# EAGLE design Rocketometer9250_2 (EAGLE 6.2)
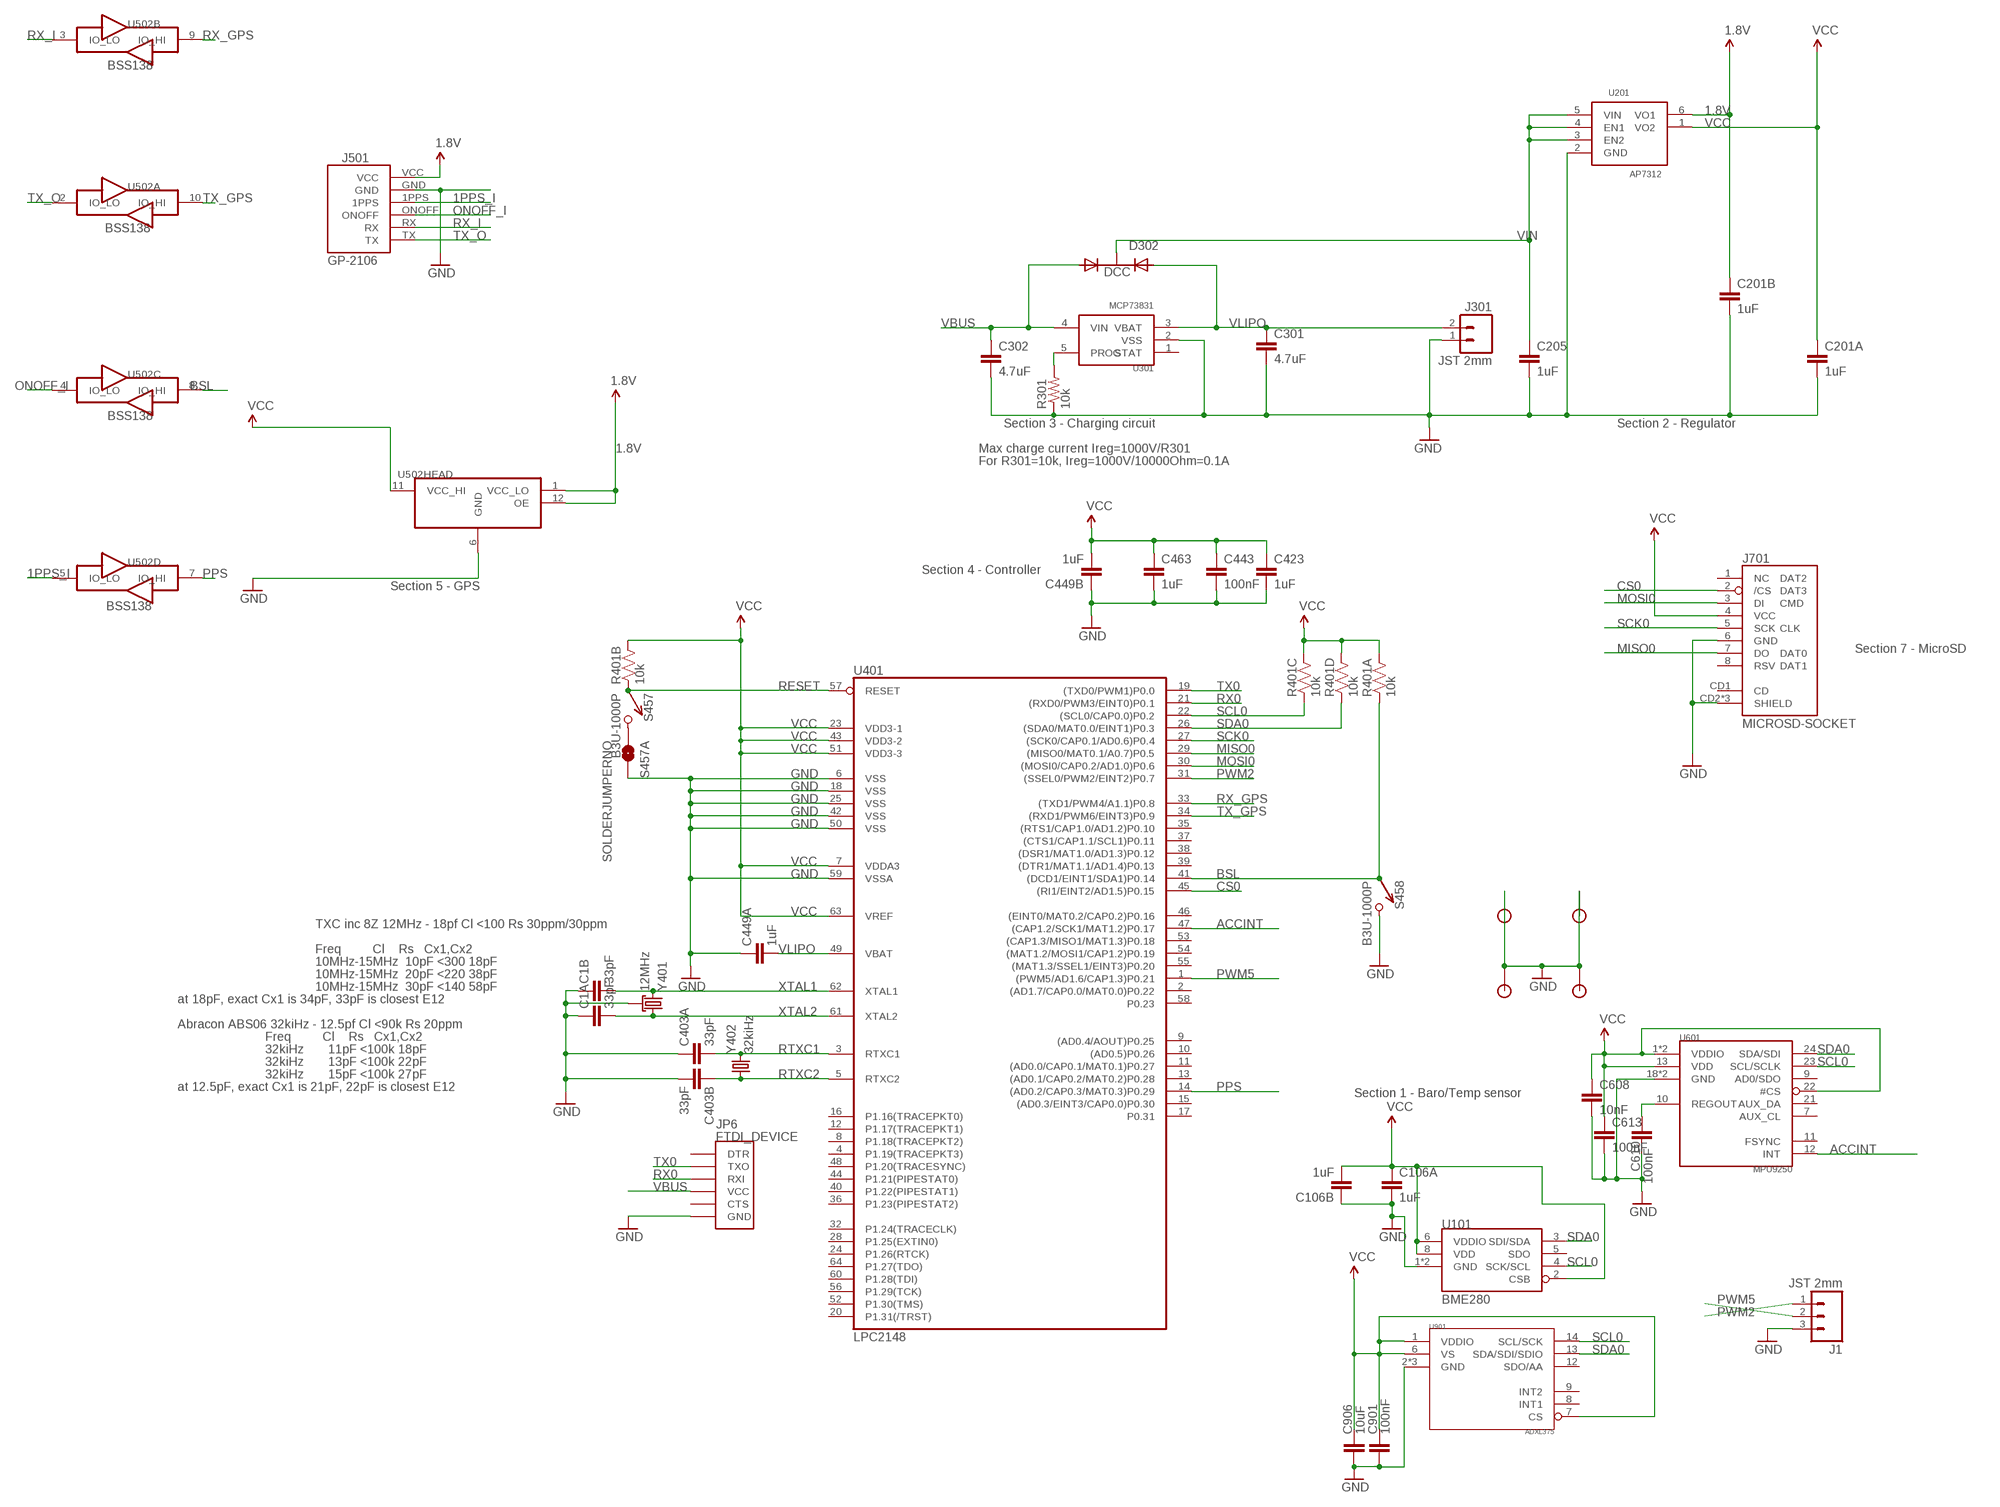
[diagram p0: schematic, sheet 1]

## Parts
C1  33pF  CKCM25  [CKCM25]
C106  1uF  CKCM25  [CKCM25]
C201  1uF  CKCM25  [CKCM25]
C205  1uF  CAP0402-CAP  [0402-CAP]
C301  4.7uF  CAP0402-CAP  [0402-CAP]
C302  4.7uF  CAP0402-CAP  [0402-CAP]
C403  33pF  CKCM25  [CKCM25]
C423  1uF  CAP0402-CAP  [0402-CAP]
C443  100nF  CAP0402-CAP  [0402-CAP]
C449  1uF  CKCM25  [CKCM25]
C463  1uF  CAP0402-CAP  [0402-CAP]
C608  10nF  CAP0402-CAP  [0402-CAP]
C610  100nF  CAP0402-CAP  [0402-CAP]
C613  100nF  CAP0402-CAP  [0402-CAP]
C901  100nF  CAP0402-CAP  [0402-CAP]
C906  10uF  CAP0603-CAP  [0603-CAP]
D302  DCC  PMEG2005CT  [SOT-23-3]
J1  JST 2mm  M031X03_NO_SILK  [1X03_NO_SILK]
J301  JST 2mm  M021X02_NO_SILK  [1X02_NO_SILK]
J501  GP-2106  [GP-2106]
J701  MICROSD-SOCKET  [MICROSD-SOCKET-PP]
JP1  STANDOFF  [STANDOFF]
JP2  STANDOFF  [STANDOFF]
JP4  STANDOFF  [STANDOFF]
JP5  STANDOFF  [STANDOFF]
JP6  FTDI_DEVICE  [FTDI_DEVICE_SIDE]
R301  10k  RESISTOR0402-RES  [0402-RES]
R401  10k  RP404  [CRA04]
S457  B3U-1000P  [B3U-1000P]
S457A  SOLDERJUMPERNO  [SJ_2S-NO]
S458  B3U-1000P  [B3U-1000P]
U101  BME280  [BME280]
U201  AP7312  AP73X2  [SOT-23-6]
U301  MCP73831  [SOT-23-5]
U401  LPC2148  LPC213X  [SQFP-S-10X10-64]
U502  TXB0104RUT  [R-PUQFN-N12]
U601  MPU9250  [LQFN_3MM_3MM]
U901  ADXL375  [ADXL375]
Y401  12MHz  CX2520  [CRYSTAL_SMD_2MM_2_5MM]
Y402  32kiHz  ABS06  [ABS06]

## Nets
1.8V: C201.2 J501.VCC U201.6(VO1) U502.1(HEAD:VCC_LO) U502.12(HEAD:OE)
1PPS_I: J501.1PPS U502.5(D:IO_LO)
ACCINT: U401.47((CAP1.2/SCK1/MAT1.2)P0.17) U601.12(INT)
BSL: R401.1 S458.P$1 U401.41((DCD1/EINT1/SDA1)P0.14) U502.8(C:IO_HI)
CS0: J701.2(/CS) U401.45((RI1/EINT2/AD1.5)P0.15)
GND [power]: C1.1 C1.2 C106.2 C106.4 C201.3 C201.4 C205.2 C301.2 C302.2 C403.1 C403.3 C423.2 C443.2 C449.1 C449.2 C463.2 C608.2 C610.2 C613.2 C901.2 C906.2 J1.3 J301.1 J501.GND J701.6(GND) J701.CD2(SHIELD) J701.GND1(SHIELD) J701.GND3(SHIELD) JP1.P$1 JP2.P$1 JP4.P$1 JP5.P$1 JP6.P$6(GND) R301.1 S457A.2 S458.P$2 U101.1(GND) U101.7(GND) U201.2(GND) U301.2(VSS) U401.6(VSS) U401.18(VSS) U401.25(VSS) U401.42(VSS) U401.50(VSS) U401.59(VSSA) U502.6(HEAD:GND) U601.18(GND) U601.20(GND) U901.2(GND) U901.4(GND) U901.5(GND) Y401.2(GND) Y401.4(GND)
MISO0: J701.7(DO) U401.29((MISO0/MAT0.1/A0.7)P0.5)
MOSI0: J701.3(DI) U401.30((MOSI0/CAP0.2/AD1.0)P0.6)
N$2: R301.2 U301.5(PROG)
N$8: S457.P$2 S457A.1
N$13: C610.1 U601.10(REGOUT)
ONOFF_I: J501.ONOFF U502.4(C:IO_LO)
PPS: U401.14((AD0.2/CAP0.3/MAT0.3)P0.29) U502.7(D:IO_HI)
PWM2: J1.1 U401.31((SSEL0/PWM2/EINT2)P0.7)
PWM5: J1.2 U401.1((PWM5/AD1.6/CAP1.3)P0.21)
RESET [power]: R401.2 S457.P$1 U401.57(RESET)
RTXC1: C403.4 U401.3(RTXC1) Y402.2
RTXC2: C403.2 U401.5(RTXC2) Y402.1
RX0: JP6.P$3(RXI) U401.21((RXD0/PWM3/EINT0)P0.1)
RX_GPS: U401.33((TXD1/PWM4/A1.1)P0.8) U502.9(B:IO_HI)
RX_I: J501.RX U502.3(B:IO_LO)
SCK0: J701.5(SCK) U401.27((SCK0/CAP0.1/AD0.6)P0.4)
SCL0: R401.3 U101.4(SCK/SCL) U401.22((SCL0/CAP0.0)P0.2) U601.23(SCL/SCLK) U901.14(SCL/SCK)
SDA0: R401.4 U101.3(SDI/SDA) U401.26((SDA0/MAT0.0/EINT1)P0.3) U601.24(SDA/SDI) U901.13(SDA/SDI/SDIO)
TX0: JP6.P$2(TXO) U401.19((TXD0/PWM1)P0.0)
TX_GPS: U401.34((RXD1/PWM6/EINT3)P0.9) U502.10(A:IO_HI)
TX_O: J501.TX U502.2(A:IO_LO)
VBUS [power]: C302.1 D302.1(A1) JP6.P$4(VCC) U301.4(VIN)
VCC [power]: C106.1 C106.3 C201.1 C423.1 C443.1 C449.3 C463.1 C608.1 C613.1 C901.1 C906.1 J701.4(VCC) R401.5 R401.6 R401.7 R401.8 U101.2(CSB) U101.6(VDDIO) U101.8(VDD) U201.1(VO2) U401.7(VDDA3) U401.23(VDD3-1) U401.43(VDD3-2) U401.51(VDD3-3) U401.63(VREF) U502.11(HEAD:VCC_HI) U601.1(VDDIO) U601.8(VDDIO) U601.13(VDD) U601.22(#CS) U901.1(VDDIO) U901.6(VS) U901.7(CS)
VIN: C205.1 D302.3(K) U201.3(EN2) U201.4(EN1) U201.5(VIN)
VLIPO [power]: C301.1 C449.4 D302.2(A2) J301.2 U301.3(VBAT) U401.49(VBAT)
XTAL1: C1.3 U401.62(XTAL1) Y401.3
XTAL2: C1.4 U401.61(XTAL2) Y401.1
Unconnected: J701.1(NC) J701.8(RSV) J701.CD1(CD) JP6.P$1(DTR) JP6.P$5(CTS) U101.5(SDO) U301.1(STAT) U401.2((AD1.7/CAP0.0/MAT0.0)P0.22) U401.4(P1.19(TRACEPKT3)) U401.8(P1.18(TRACEPKT2)) U401.9((AD0.4/AOUT)P0.25) U401.10((AD0.5)P0.26) U401.11((AD0.0/CAP0.1/MAT0.1)P0.27) U401.12(P1.17(TRACEPKT1)) U401.13((AD0.1/CAP0.2/MAT0.2)P0.28) U401.15((AD0.3/EINT3/CAP0.0)P0.30) U401.16(P1.16(TRACEPKT0)) U401.17(P0.31) U401.20(P1.31(/TRST)) U401.24(P1.26(RTCK)) U401.28(P1.25(EXTIN0)) U401.32(P1.24(TRACECLK)) U401.35((RTS1/CAP1.0/AD1.2)P0.10) U401.36(P1.23(PIPESTAT2)) U401.37((CTS1/CAP1.1/SCL1)P0.11) U401.38((DSR1/MAT1.0/AD1.3)P0.12) U401.39((DTR1/MAT1.1/AD1.4)P0.13) U401.40(P1.22(PIPESTAT1)) U401.44(P1.21(PIPESTAT0)) U401.46((EINT0/MAT0.2/CAP0.2)P0.16) U401.48(P1.20(TRACESYNC)) U401.52(P1.30(TMS)) U401.53((CAP1.3/MISO1/MAT1.3)P0.18) U401.54((MAT1.2/MOSI1/CAP1.2)P0.19) U401.55((MAT1.3/SSEL1/EINT3)P0.20) U401.56(P1.29(TCK)) U401.58(P0.23) U401.60(P1.28(TDI)) U401.64(P1.27(TDO)) U601.7(AUX_CL) U601.9(AD0/SDO) U601.11(FSYNC) U601.21(AUX_DA) U901.8(INT1) U901.9(INT2) U901.12(SDO/AA)

## Notes on the sheet
- BSS138
- BSS138
- BSS138
- Section 3 - Charging circuit | Section 2 - Regulator
- Max charge current Ireg=1000V/R301
- For R301=10k, Ireg=1000V/10000Ohm=0.1A
- Section 4 - Controller
- Section 5 - GPS
- BSS138
- Section 7 - MicroSD
- TXC inc 8Z 12MHz - 18pf Cl <100 Rs 30ppm/30ppm
- Freq         Cl    Rs   Cx1,Cx2
- 10MHz-15MHz  10pF <300 18pF
- 10MHz-15MHz  20pF <220 38pF
- 10MHz-15MHz  30pF <140 58pF
- at 18pF, exact Cx1 is 34pF, 33pF is closest E12
- Abracon ABS06 32kiHz - 12.5pf Cl <90k Rs 20ppm
- Freq         Cl    Rs   Cx1,Cx2
- 32kiHz       11pF <100k 18pF
- 32kiHz       13pF <100k 22pF
- 32kiHz       15pF <100k 27pF
- at 12.5pF, exact Cx1 is 21pF, 22pF is closest E12
- Section 1 - Baro/Temp sensor

## Library data of the parts
C1 C106 C201 C403 C449 = KwanSystems:CKC
C205 C423 C463 = SparkFun:CAP: Capacitor Standard 0603 ceramic capacitor, and 0.1" leaded capacitor.; DIGIKEY: 445-4114-1-ND
C301 C302 = SparkFun:CAP: Capacitor Standard 0603 ceramic capacitor, and 0.1" leaded capacitor.; DIGIKEY: 445-7395-1-ND
C443 C610 C613 = SparkFun:CAP: Capacitor Standard 0603 ceramic capacitor, and 0.1" leaded capacitor.; DIGIKEY: 445-1265-1-ND
C608 = SparkFun:CAP: Capacitor Standard 0603 ceramic capacitor, and 0.1" leaded capacitor.; DIGIKEY: 445-1257-1-ND
C901 = SparkFun-Passives:CAP: Capacitor Standard 0603 ceramic capacitor, and 0.1" leaded capacitor.; DIGIKEY: 445-1265-1-ND
C906 = SparkFun:CAP: Capacitor Standard 0603 ceramic capacitor, and 0.1" leaded capacitor.; DIGIKEY: 445-7486-1-ND
D302 = KwanSystems:PMEG2005CT; DIGIKEY: 568-6500-1-ND
J1 = SparkFun-Connectors:M03: Header 3 Standard 3-pin 0.1" header. Use with straight break away headers (SKU : PRT-00116), right angle break away headers (PRT-00553), swiss pins (PRT-00743), machine pins (PRT-00117), and female headers (PRT-00115). Molex polarized connector foot print use with SKU : PRT-08232 with associated crimp pins and housings.; DIGIKEY: 455-1749-1-ND
J301 = SparkFun-Connectors:M02: Standard 2-pin 0.1" header. Use with - straight break away headers ( PRT-00116) - right angle break away headers (PRT-00553) - swiss pins (PRT-00743) - machine pins (PRT-00117) - female headers (PRT-00115) Molex polarized connector foot print use with: PRT-08233 with associated crimp pins and housings. 2.54_SCREWTERM for use with PRT-10571. 3.5mm Screw Terminal footprints for PRT-08084 5mm Screw Terminal footprints for use with PRT-08432; DIGIKEY: 455-1749-1-ND
J501 = SparkFun:GP-2106: GP-2106 GPS SiRF IV
J701 = KwanSystems:MICROSD-SOCKET: microSD Socket Push-push type uSD socket. Digikey 101-00660-68-6-1-ND. tDoc lines correctly indicate media card edge positions when inserting (unlocked, locked, depressed).; DIGIKEY: 101-00581-59-1-ND
JP1 JP2 JP4 JP5 = KwanSystems:STANDOFF; DIGIKEY: $NOPART
JP6 = SparkFun-Connectors:FTDI_DEVICE: Connector which mates to FTDI basic or FTDI cable.
R301 = SparkFun:RESISTOR: Resistor Basic schematic elements and footprints for 0603, 1206, and PTH resistors.; DIGIKEY: P10.0KLCT-ND
R401 = KwanSystems:RP4; DIGIKEY: CRA4S810KCT-ND
S457 S458 = KwanSystems:B3U-1000P; DIGIKEY: SW1020CT-ND
S457A = SparkFun-Passives:SOLDERJUMPER: Solder Jumper Standard SMD solder jumper. Used to automate production. Two varients : Normally Open and Normally Closed are the same, but have different paste layers. NC will have a large amount of paste and should jumper during reflow.; DIGIKEY: $NOPART
U101 = KwanSystems:BME280
U201 = KwanSystems:AP73X2: Dual 300mA LDO Regulator http://www.diodes.com/datasheets/AP7332.pdf
U301 = KwanSystems:MCP73831; DIGIKEY: 576-1910-1-ND
U401 = SparkFun:LPC213X: LPC213x Schematic element and footprint for NXP LPC213x. Spark Fun Electronics SKU : COM-00520; DIGIKEY: 568-1765-ND
U502 = KwanSystems:TXB0104
U601 = KwanSystems:MPU9250
U901 = KwanSystems:ADXL375
Y401 = KwanSystems:CX2520; DIGIKEY: 887-1487-1-ND
Y402 = KwanSystems:ABS06; DIGIKEY: 535-10104-1-ND

## Net classes
0 default: width 0.152 mm, drill 0.33 mm, clearance 0.152 mm
1 power: width 0.152 mm, drill 0.33 mm, clearance 0.152 mm to class 0, clearance 0.152 mm
2 hv: width 0.152 mm, drill 0.33 mm, clearance 0.152 mm to class 0, clearance 0.152 mm to class 1, clearance 0.152 mm

## Board
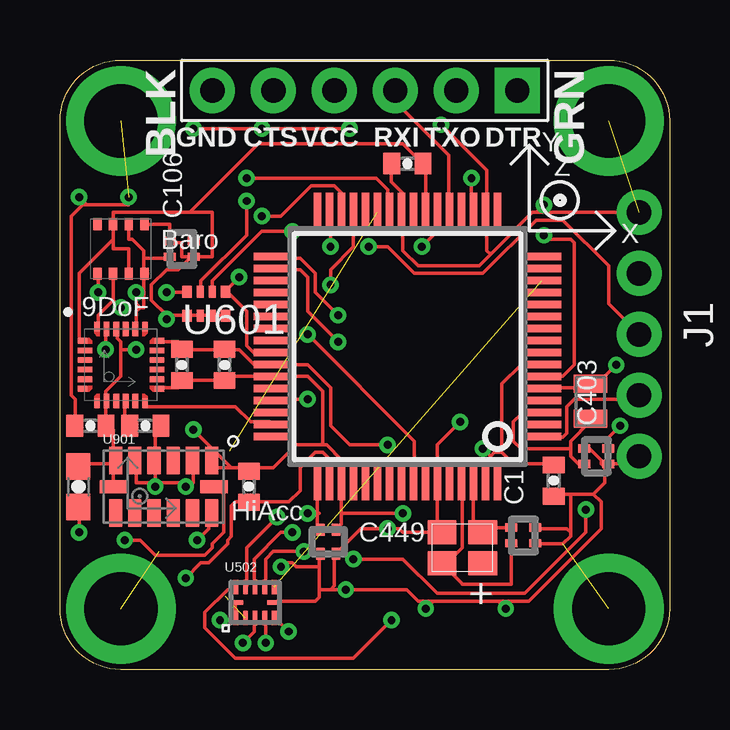
[diagram p1: board, top side]
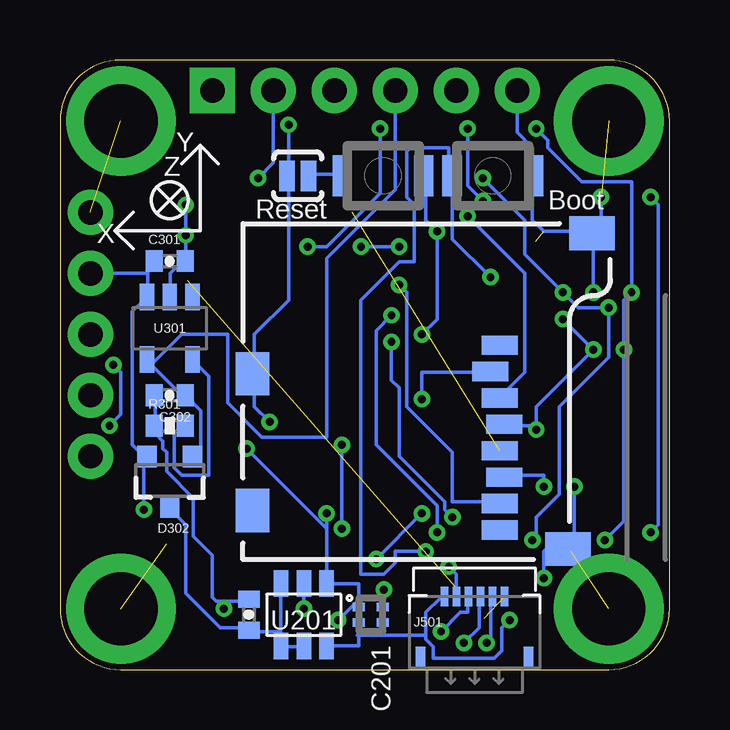
[diagram p2: board, bottom side, seen from below]

Size 25.4 x 25.4 mm. Coordinates in mm from the lower left corner, seen from the top.
Outline: 2.54,25.4 22.86,25.4 arc-90 25.4,22.86 25.4,2.54 arc-90 22.86,0 2.54,0 arc-90 0,2.54 0,22.86 arc-90 2.54,25.4
Copper layers (1*16): Top 0.0356mm / dielectric 1.5011mm / Bottom 0.0356mm
Design rules "default": minimum track width 6mil, minimum drill 13mil, track to track 6mil, track to pad 6mil, pad to pad 6mil, via to via 6mil, smd to smd 6mil, copper to edge 15mil, drill to drill 6mil, minimum pad ring 7mil, minimum via ring 7mil, stop-mask expansion 4mil, vias tented up to drill 14mil, thermal gap 10mil

### Footprints (pad centres in the part's own frame; a part is rotated, then mirrored left to right if it is on the bottom)
CKCM25 = smd 0.35 x 0.5: 1 -0.325,-0.5; 2 0.325,-0.5; 3 0.325,0.5; 4 -0.325,0.5
0402-CAP = smd 0.7 x 0.9: 1 -0.65,0; 2 0.65,0
0603-CAP = smd 1.1 x 1: 1 -0.85,0; 2 0.85,0
SOT-23-3 = smd 0.9 x 0.8: 1 -1,0.95; 2 -1,-0.95; 3 1.1,0
1X03_NO_SILK = drill 1.016 pad 1.88: 1 0,0; 2 2.54,0; 3 5.08,0
1X02_NO_SILK = drill 1.016 pad 1.88: 1 0,0; 2 2.54,0
GP-2106 = smd 0.3 x 0.8: 1PPS -0.25,0; GND -0.75,0; ONOFF 0.25,0; RX 0.75,0; TX 1.25,0; VCC -1.25,0 | smd 0.4 x 0.8: P$7 -2.25,-2.5; P$8 2.25,-2.5
MICROSD-SOCKET-PP = smd 0.8 x 1.5: 1 -8.94,10.7; 2 -7.84,10.3; 3 -6.74,10.7; 4 -5.64,10.9; 5 -4.54,10.7; 6 -3.44,10.9; 7 -2.34,10.7; 8 -1.24,10.7 | smd 1.8 x 1.4: CD1 -2.05,0.4; CD2 -7.75,0.4 | smd 1.4 x 1.9: GND1 -13.6,14.55; GND3 -0.45,13.55
STANDOFF = drill 3.048 pad 4.572: P$1 0,0
FTDI_DEVICE_SIDE = drill 1.016 pad 1.88 square: P$1 -6.35,0 | drill 1.016 pad 1.88: P$2 -3.81,0; P$3 -1.27,0; P$4 1.27,0; P$5 3.81,0; P$6 6.35,0
0402-RES = smd 0.7 x 0.9: 1 -0.65,0; 2 0.65,0
CRA04 = smd 0.4 x 0.5: 1 -0.8,-0.5; 4 0.8,-0.5; 5 0.8,0.5; 8 -0.8,0.5 | smd 0.3 x 0.5: 2 -0.25,-0.5; 3 0.25,-0.5; 6 0.25,0.5; 7 -0.25,0.5
B3U-1000P = smd 0.8 x 1.7: P$1 -1.7,0; P$2 1.7,0
SJ_2S-NO = smd 0.635 x 1.27: 1 -0.45,0; 2 0.45,0
BME280 = smd 0.35 x 0.5: 1 -0.975,1.025; 2 -0.325,1.025; 3 0.325,1.025; 4 0.975,1.025; 5 0.975,-1.025; 6 0.325,-1.025; 7 -0.325,-1.025; 8 -0.975,-1.025
SOT-23-6 = smd 0.6 x 1.1: 1 -0.95,-1.3; 2 0,-1.3; 3 0.95,-1.3; 4 0.95,1.3; 5 0,1.3; 6 -0.95,1.3
SOT-23-5 = smd 0.6 x 1.1: 1 -0.95,-1.3; 2 0,-1.3; 3 0.95,-1.3; 4 0.95,1.3; 5 -0.95,1.3
SQFP-S-10X10-64 = smd 0.3 x 1.6: 1 -3.75,-5.6; 2 -3.25,-5.6; 3 -2.75,-5.6; 4 -2.25,-5.6; 5 -1.75,-5.6; 6 -1.25,-5.6; 7 -0.75,-5.6; 8 -0.25,-5.6; 9 0.25,-5.6; 10 0.75,-5.6; 11 1.25,-5.6; 12 1.75,-5.6; 13 2.25,-5.6; 14 2.75,-5.6; 15 3.25,-5.6; 16 3.75,-5.6; 33 3.75,5.6; 34 3.25,5.6; 35 2.75,5.6; 36 2.25,5.6; 37 1.75,5.6; 38 1.25,5.6; 39 0.75,5.6; 40 0.25,5.6; 41 -0.25,5.6; 42 -0.75,5.6; 43 -1.25,5.6; 44 -1.75,5.6; 45 -2.25,5.6; 46 -2.75,5.6; 47 -3.25,5.6; 48 -3.75,5.6 | smd 1.6 x 0.3: 17 5.6,-3.75; 18 5.6,-3.25; 19 5.6,-2.75; 20 5.6,-2.25; 21 5.6,-1.75; 22 5.6,-1.25; 23 5.6,-0.75; 24 5.6,-0.25; 25 5.6,0.25; 26 5.6,0.75; 27 5.6,1.25; 28 5.6,1.75; 29 5.6,2.25; 30 5.6,2.75; 31 5.6,3.25; 32 5.6,3.75; 49 -5.6,3.75; 50 -5.6,3.25; 51 -5.6,2.75; 52 -5.6,2.25; 53 -5.6,1.75; 54 -5.6,1.25; 55 -5.6,0.75; 56 -5.6,0.25; 57 -5.6,-0.25; 58 -5.6,-0.75; 59 -5.6,-1.25; 60 -5.6,-1.75; 61 -5.6,-2.25; 62 -5.6,-2.75; 63 -5.6,-3.25; 64 -5.6,-3.75
R-PUQFN-N12 = smd 0.2 x 0.6: 1 -0.8,-0.65; 2 -0.4,-0.65; 3 0,-0.65; 4 0.4,-0.65; 5 0.8,-0.65; 7 0.8,0.65; 8 0.4,0.65; 9 0,0.65; 10 -0.4,0.65; 11 -0.8,0.65 | smd 0.6 x 0.2: 6 0.8,0; 12 -0.8,0
LQFN_3MM_3MM = smd 0.4 x 0.24: 1 -1.6,1; 6 -1.6,-1; 13 1.6,-1; 18 1.6,1 | smd 0.6 x 0.24: 2 -1.5,0.6; 3 -1.5,0.2; 4 -1.5,-0.2; 5 -1.5,-0.6; 14 1.5,-0.6; 15 1.5,-0.2; 16 1.5,0.2; 17 1.5,0.6 | smd 0.24 x 0.4: 7 -1,-1.6; 12 1,-1.6; 19 1,1.6; 24 -1,1.6 | smd 0.24 x 0.6: 8 -0.6,-1.5; 9 -0.2,-1.5; 10 0.2,-1.5; 11 0.6,-1.5; 20 0.6,1.5; 21 0.2,1.5; 22 -0.2,1.5; 23 -0.6,1.5
ADXL375 = smd 0.55 x 1.145: 1 2,1.097; 2 1.2,1.097; 3 0.4,1.097; 4 -0.4,1.097; 5 -1.2,1.097; 6 -2,1.097; 8 -2,-1.097; 9 -1.2,-1.097; 10 -0.4,-1.097; 11 0.4,-1.097; 12 1.2,-1.097; 13 2,-1.097 | smd 1.145 x 0.55: 7 -2.098,0; 14 2.098,0
CRYSTAL_SMD_2MM_2_5MM = smd 1.2 x 1: 1 -0.85,-0.65; 2 0.85,-0.65; 3 0.85,0.65; 4 -0.85,0.65
ABS06 = smd 0.75 x 1.4: 1 -0.725,0; 2 0.725,0

### Placement (x,y rotation side)
C1  19.3,5.59 90 top
C106  5.08,17.53 90 top
C201  12.45,2.29 270 bottom
C205  17.53,2.29 90 bottom
C301  20.83,17.02 0 bottom
C302  20.83,11.43 180 bottom
C403  22.35,8.89 90 top
C423  14.48,21.08 180 top
C443  6.86,12.7 90 top
C449  11.18,5.33 0 top
C463  20.57,7.87 270 top
C608  1.27,10.16 180 top
C610  3.56,10.16 0 top
C613  5.08,12.7 90 top
C901  7.87,7.62 270 top
C906  0.76,7.62 270 top
D302  20.83,7.87 270 bottom
J1  24.13,13.97 270 top
J301  24.13,19.05 270 bottom
J501  8.13,3.05 0 bottom
J701  17.78,4.58 270 bottom
JP1  2.54,2.54 0 top
JP2  2.54,22.86 0 top
JP4  22.86,2.54 0 top
JP5  22.86,22.86 0 top
JP6  12.7,24.13 180 top
R301  20.83,10.16 0 bottom
R401  6.1,15.24 180 top
S457  11.94,20.57 180 bottom
S457A  15.49,20.57 180 bottom
S458  7.37,20.57 0 bottom
U101  2.54,17.53 180 top
U201  15.24,2.29 180 bottom
U301  20.83,14.22 180 bottom
U401  14.48,13.46 90 top
U502  8.13,2.79 0 top
U601  2.54,12.7 0 top
U901  4.32,7.62 0 top
U$4  [AXES]  19.56,18.29 0 top
Y401  16.76,5.08 0 top
Y402  22.1,11.18 270 top

### Tracks (layer width: path | path; a pad name or v marks a point on that pad's centre or on a via)
1.8V  (via drill 0.33)
  Top 0.152: U502.12 7.3,2.7 7.3,2.22 U502.1 7.3,2.06 v6.67,2.06
  Bottom 0.152: C201.2 12.95,1.43 | 12.95,1.43 12.95,0.99 U201.6 | v6.67,2.06 6.99,1.75 6.99,0.79 7.3,0.48 9.84,0.48 9.84,0.95 10.16,1.27 10.16,1.43 | 10.16,1.43 10.16,2.38 9.53,3.02 J501.VCC | 10.16,1.43 12.95,1.43 | 13.02,1.43 12.95,1.43
1PPS_I  (via drill 0.33)
  Top 0.152: v9.53,1.59 8.89,2.22 U502.5
  Bottom 0.152: v9.53,1.59 8.73,2.38 8.41,2.38 8.41,3.02 J501.1PPS
ACCINT
  Top 0.152: U601.12 3.65,10.95 7.3,10.95 7.94,10.32 8.73,10.32 U401.47
BSL  (via drill 0.33)
  Top 0.152: U401.41 8.73,13.18 8.1,13.18 7.78,13.49 7.78,14.92 6.99,15.72 R401.1 6.99,15.88 v7.46,16.35 | v10.16,4.92 8.89,4.92 8.57,4.6 8.57,3.49 U502.8
  Bottom 0.152: v10.16,4.92 11.43,4.92 11.43,4.45 11.91,3.97 12.86,3.97 12.86,15.4 11.27,16.99 10.64,16.99 10.64,19.37 10.95,19.68 10.95,21.59 10.79,21.75 9.21,21.75 9.21,20.64 S458.P$1 9.05,20.48 9.05,17.94 v7.46,16.35
CS0  (via drill 0.33)
  Top 0.152: v10.32,11.27 8.89,11.27 U401.45
  Bottom 0.152: v10.32,11.27 10.32,12.38 7.62,12.38 J701.2
GND  (via drill 0.33)  (5 unrouted)
  Top 0.152: U601.18 4.29,13.65 4.92,13.65 5.08,13.49 C613.2 5.08,13.34 6.83,13.34 C443.2 6.99,13.34 7.46,13.34 8.1,12.7 8.73,12.7 U401.42 10.32,12.7 11.27,11.75 11.27,10.16 12.06,9.37 v13.65,9.37 | 15.72,5.71 15.72,7.78 U401.59 15.72,7.94 15.72,9.37 v16.67,10.32 | 15.72,5.71 15.88,5.71 Y401.4 15.72,5.71 | 15.72,5.71 14.29,5.71 14.13,5.87 v13.65,5.87 12.54,5.87 11.59,4.92 C449.2 11.43,4.76 11.43,3.49 11.27,3.33 | 21.27,5.71 21.27,5.56 20.95,5.24 19.84,5.24 C1.1 | 21.27,5.71 21.11,5.87 19.84,5.87 C1.2 | 21.27,7.3 20.64,7.3 C463.2 | 21.27,5.71 21.27,7.3 | J1.3 24.13,8.73 23.97,8.57 C403.1 22.7,8.41 | 22.7,8.41 22.54,8.57 22.54,8.73 22.07,9.21 21.91,9.21 C403.3 | 22.23,7.3 21.27,7.3 | 22.23,7.3 22.7,7.78 22.7,8.41 | 10.79,3.33 10.79,3.02 10.64,2.86 9.05,2.86 U502.6 | 10.79,3.33 10.79,4.29 | 10.79,4.29 10.79,4.76 C449.1 | 10.79,3.33 11.27,3.33 | 11.27,3.33 v11.91,3.33 14.45,3.33 14.92,2.86 15.56,2.86 | v9.21,4.29 9.37,4.45 9.68,4.45 9.84,4.29 10.79,4.29 | 18.26,2.86 v18.57,2.54 | 15.56,2.86 18.26,2.86 | v15.24,2.54 15.56,2.86 | 22.23,7.3 22.54,6.99 22.54,5.87 19.53,2.86 18.26,2.86 | v20.16,18.1 20.32,17.94 21.27,17.94 21.43,17.78 21.43,12.7 20.95,12.22 20.16,12.22 U401.6 | C423.2 13.81,20.95 13.81,20.32 14.29,19.84 14.29,19.21 U401.25 14.29,19.05 14.29,17.46 14.92,16.83 17.46,16.83 17.94,17.3 | v15.88,22.7 17.78,20.8 17.78,19.21 U401.18 17.78,19.05 17.78,17.46 17.94,17.3 | 19.84,19.05 v20.16,19.37 | 19.84,19.05 19.68,19.05 17.94,17.3 | 19.84,19.05 J301.1 | 5.56,8.73 U901.2 5.56,8.57 5.56,7.78 5.24,7.78 | 3.17,8.73 U901.5 3.17,8.57 3.17,7.78 3.81,7.78 | C610.2 4.13,10.16 4.13,9.84 3.97,9.68 3.97,8.73 U901.4 3.97,8.57 3.97,7.78 3.81,7.78
  Top 0.152: 5.24,7.78 4.13,7.78 v3.97,7.62 3.81,7.78 | 5.24,7.78 v5.24,7.62 | 2.86,18.57 U101.7 2.86,18.41 2.86,17.94 3.02,17.94 3.49,17.46 3.49,17.14 | 3.65,16.51 U101.1 | 3.33,15.08 3.49,15.08 3.49,16.35 U101.1 | 3.33,15.08 3.17,14.92 3.17,14.29 U601.20 | 3.49,17.14 4.45,17.14 C106.4 | 3.49,17.14 3.49,16.51 U101.1 | 1.11,19.37 2.86,19.37 v2.86,19.68 | 1.11,19.37 0.95,19.37 0.48,18.89 0.48,11.43 0.64,11.27 0.64,10.16 C608.2 | v5.24,3.81 5.87,4.45 6.19,4.45 6.99,5.24 6.99,5.4 7.14,5.56 7.14,6.83 7.3,6.99 7.78,6.99 C901.2 7.94,6.99 9.53,6.99 10,7.46 10,8.41 10.64,9.05 10.95,9.05 11.27,8.73 11.27,7.94 U401.50 | v0.79,5.71 0.79,6.67 C906.2 | 1.11,19.37 v0.79,19.68 | 3.33,15.08 3.17,15.24 v3.17,15.72
  Bottom 0.152: v13.65,5.87 v13.65,9.37 | C201.3 11.91,2.06 11.91,2.54 C201.4 11.91,2.7 v11.91,3.33 | v9.21,4.29 8.89,3.97 8.89,3.17 J501.GND | 21.43,10.16 21.43,11.43 C302.2 | 18.57,2.86 17.62,2.86 C205.2 | U201.2 v15.24,2.54 | 21.43,10.16 21.43,9.84 21.11,9.53 21.11,9.21 20.95,9.05 20.95,8.26 19.84,7.14 19.84,5.56 19.05,4.76 19.05,3.02 18.89,2.86 18.57,2.86 | 21.43,10.16 R301.1 | 18.57,2.86 v18.57,2.54 | U301.2 20.8,15.56 20.8,16.51 20.32,16.99 C301.2 20.16,17.14 v20.16,18.1 v20.16,19.37 | v15.88,22.7 15.88,20.64 S457A.2 15.88,20.48 15.88,15.4 17.3,13.97 17.3,12.38 J701.CD2 17.3,12.22 17.3,10.95 v16.67,10.32 | JP6.P$6 6.35,22.38 5.71,21.75 5.71,20.64 S458.P$2 5.71,20.48 5.71,18.73 5.24,18.26 3.33,18.26 J701.GND1 | v5.24,7.62 5.24,8.1 6.83,8.1 J701.6 | v2.86,19.68 2.86,18.26 3.17,18.26 J701.GND1 | v5.24,3.81 5.24,4.92 5.08,5.08 4.29,5.08 J701.GND3 4.13,4.92 3.97,5.08 v3.97,7.62 | v0.79,5.71 0.48,6.03 0.48,19.37 v0.79,19.68 | v3.17,15.72 3.17,18.1 J701.GND1
MISO0  (via drill 0.33)
  Top 0.152: v11.27,16.03 11.27,16.67 12.22,17.62 U401.29
  Bottom 0.152: v11.27,16.03 10.95,15.72 10.95,10.95 9.05,9.05 9.05,6.99 7.14,6.99 J701.7
MOSI0  (via drill 0.33)
  Top 0.152: v8.41,18.89 9.21,18.89 10.48,20.16 11.43,20.16 11.75,19.84 11.75,19.21 U401.30
  Bottom 0.152: v8.41,18.89 6.03,16.51 6.03,12.38 6.99,11.43 J701.3
N$2
  Bottom 0.152: R301.2 20.32,10.16 20.64,9.84 20.64,8.41 20.32,8.1 19.21,8.1 19.21,12.22 19.84,12.86 U301.5
N$8
  Bottom 0.152: S457A.1 14.92,20.64 13.65,20.64 S457.P$2
N$13
  Top 0.152: U601.10 2.7,11.11 2.7,10.32 2.86,10.16 C610.1
ONOFF_I  (via drill 0.33)
  Top 0.152: v8.57,1.11 8.57,2.06 U502.4
  Bottom 0.152: v8.57,1.11 7.94,1.75 7.94,3.02 J501.ONOFF
PPS  (1 unrouted)
PWM2  (via drill 0.33)
  Top 0.152: v11.27,17.62 11.27,19.05 U401.31 | v12.86,17.62 13.65,17.62 14.76,16.51 17.62,16.51 19.84,18.73 20.95,18.73 22.86,16.83 22.86,15.24 J1.1
  Bottom 0.152: v12.86,17.62 v11.27,17.62
PWM5
  Top 0.152: J1.2 23.97,11.27 21.43,11.27 21.11,10.95 21.11,9.84 20.95,9.68 20.16,9.68 U401.1
RESET  (via drill 0.33)
  Top 0.152: v9.68,18.26 8.41,18.26 6.35,16.19 6.35,15.88 R401.2 | v10.32,13.97 14.76,9.53 14.76,7.94 U401.57
  Bottom 0.152: S457.P$1 10.16,20.48 10.16,18.73 v9.68,18.26 9.68,14.61 v10.32,13.97
RTXC1
  Top 0.152: 21.27,9.21 21.27,9.53 22.07,10.32 Y402.2 | 21.27,9.21 21.27,8.89 21.59,8.57 21.75,8.57 C403.4 | 21.27,9.21 19.21,9.21 18.89,9.53 18.89,10.32 19.21,10.64 20,10.64 U401.3
RTXC2  (via drill 0.33)
  Top 0.152: v23.34,10.16 22.86,9.68 22.86,9.37 C403.2 | v23.18,12.7 22.23,11.75 Y402.1 22.07,11.75 20.16,11.75 U401.5
  Bottom 0.152: v23.34,10.16 22.86,10.64 22.86,12.38 v23.18,12.7
RX0
  Top 0.152: JP6.P$3 13.97,23.65 16.19,21.43 16.19,19.21 U401.21
RX_GPS  (via drill 0.33)
  Top 0.152: v9.68,5.71 9.21,5.71 8.1,4.6 8.1,3.49 U502.9 | v11.59,14.76 10.64,15.72 10.64,16.51 10,17.14 8.89,17.14 U401.33
  Bottom 0.152: v9.68,5.71 9.68,6.83 12.22,9.37 12.22,14.13 v11.59,14.76
RX_I  (via drill 0.33)
  Top 0.152: v7.62,1.11 8.1,1.59 8.1,2.06 U502.3
  Bottom 0.152: v7.62,1.11 7.46,1.27 7.46,3.02 J501.RX
SCK0  (1 unrouted)
SCL0  (via drill 0.33)
  Top 0.152: v1.59,15.72 1.59,16.35 U101.4 | v1.91,13.34 1.91,14.13 U601.23 | v7.78,19.53 7.78,18.1 5.87,16.19 5.87,15.88 R401.3 | v5.56,22.54 v8.41,22.54 v12.06,22.54 | v2.7,5.4 3.33,5.4 3.97,4.76 6.03,4.76 6.35,5.08 6.35,5.24 6.83,5.71 6.83,7.3 6.51,7.62 U901.14 | v15.08,17.62 15.72,18.26 15.72,19.05 U401.22
  Bottom 0.152: v7.78,19.53 8.41,20.16 v8.41,22.54 | v5.56,22.54 5.08,22.07 5.08,21.75 3.65,20.32 1.59,20.32 v1.59,15.72 1.91,15.4 v1.91,13.34 1.91,6.19 v2.7,5.4 | v15.08,17.62 14.29,17.62 12.06,19.84 v12.06,22.54
SDA0  (via drill 0.33)
  Top 0.152: 2.22,15.4 1.59,14.76 1.59,14.45 U601.24 | 2.22,15.4 2.22,16.35 U101.3 | v4.45,15.72 5.24,15.72 R401.4 | 2.22,15.4 v2.54,15.08 | v5.71,5.4 6.19,5.87 6.19,6.51 U901.13 | v7.78,20.48 13.18,20.48 13.65,20 13.65,19.21 U401.26
  Bottom 0.152: v5.71,5.4 5.56,5.56 5.56,6.35 4.6,7.3 4.6,10.95 2.54,13.02 v2.54,15.08 3.81,15.08 v4.45,15.72 6.03,17.3 6.03,18.73 v7.78,20.48
TX0  (via drill 0.33)
  Top 0.152: v17.14,20.48 17.14,19.21 U401.19
  Bottom 0.152: v17.14,20.48 16.51,21.11 JP6.P$2
TX_GPS  (via drill 0.33)
  Top 0.152: v11.59,13.65 10.32,14.92 10.32,16.35 10,16.67 8.89,16.67 U401.34 | v9.05,6.35 7.78,5.08 7.78,3.49 U502.10
  Bottom 0.152: v11.59,13.65 11.59,12.06 11.27,11.75 11.27,8.89 9.37,6.99 9.37,6.67 v9.05,6.35
TX_O  (1 unrouted)
VBUS
  Bottom 0.152: D302.1 19.84,8.89 19.53,9.21 19.53,10.79 20.16,11.43 C302.1 20.32,11.43 21.59,12.7 | 21.59,12.7 21.75,12.86 U301.4 21.59,12.7 | 21.59,12.7 20.32,13.97 18.41,13.97 18.41,11.11 16.99,9.68 14.29,9.68 14.29,17.14 11.43,20 JP6.P$4
VCC  (via drill 0.33)
  Top 0.152: C449.3 11.73,6.06 11.73,6.51 | 11.73,6.51 U401.51 11.75,7.94 11.75,8.73 11.11,9.37 10.95,9.37 | U101.8 4.58,18.55 C106.3 4.58,17.78 5.08,17.78 5.08,17.2 C106.1 | 5.4,19.05 2.21,19.05 U101.6 2.21,17.94 | 5.4,19.05 6.35,19.05 6.35,17.2 C106.1 | 2.21,17.94 2.21,17.53 2.87,17.53 U101.2 | U401.23 15.24,19.21 15.24,20.95 C423.1 15.08,21.11 14.29,21.91 8.26,21.91 5.4,19.05 | 6.35,14.76 5.87,14.76 R401.6 5.71,14.76 5.4,14.76 R401.5 5.24,14.76 4.45,14.76 | 6.35,14.76 6.83,14.76 R401.8 | 6.35,14.76 R401.7 | U601.1 0.79,13.81 0.79,16.51 2.22,17.94 2.21,17.94 | 4.45,14.76 3.81,15.4 3.81,16.03 4.45,16.67 4.92,16.67 5.4,17.14 C106.1 | 18.41,9.05 18.89,8.57 20.48,8.57 C463.1 | 18.41,9.05 18.1,9.05 17.94,8.89 | 17.94,8.89 17.78,8.73 17.78,7.94 U401.63 | 18.41,9.05 18.41,11.91 19.21,12.7 20,12.7 U401.7 | v13.81,2.06 12.22,0.48 7.3,0.48 6.03,1.75 6.03,2.38 6.99,3.33 7.3,3.33 U502.11 | 2.22,8.57 0.79,8.57 C906.1 | 2.22,8.57 U901.7 | 2.22,8.57 U901.6 2.22,8.73 2.22,10 2.06,10.16 C608.1 1.91,10.16 1.91,11.11 U601.8 1.91,11.27 1.91,11.59 2.54,12.22 2.54,13.34 | 2.54,13.34 2.54,13.65 2.38,13.81 2.38,14.13 U601.22 | U601.13 4.29,11.75 4.92,11.75 5.08,11.91 C613.1 5.08,12.06 6.83,12.06 C443.1 6.99,12.06 7.14,12.22 8.73,12.22 U401.43 8.89,12.22 10.32,12.22 10.95,11.59 10.95,9.37 | 7.14,8.41 6.51,8.41 6.35,8.57 U901.1 | 7.14,8.41 7.78,8.41 C901.1 7.94,8.41 8.89,8.41 9.84,9.37 10.95,9.37 | 7.14,8.41 v5.56,10 | v3.17,13.34 2.54,13.34 | 11.73,6.51 v14.29,6.51 | v17.62,9.21 17.94,8.89 | v4.45,14.61 4.45,14.76
  Bottom 0.152: C201.1 12.95,2.86 | 12.95,2.86 12.95,3.59 U201.1 14.29,3.65 14.29,5.87 | v13.81,2.06 13.02,2.86 12.95,2.86 | 5.56,10.16 6.83,10.16 J701.4 | 5.56,10.16 5.56,10.95 v3.17,13.34 v4.45,14.61 | 5.56,10.16 v5.56,10 | v14.29,6.51 14.29,5.87 | 14.29,5.87 v17.62,9.21
VIN
  Bottom 0.152: 16.19,1.59 17.46,1.59 C205.1 17.62,1.75 18.73,1.75 20.16,3.17 20.16,6.03 20.8,6.67 D302.3 | 16.19,1.59 16.19,1.11 U201.4 16.03,0.95 15.24,0.95 U201.5 | 16.19,1.59 16.19,3.49 U201.3
VLIPO  (via drill 0.33)
  Top 0.152: U401.49 10.73,6.51 | 10.73,6.51 10.73,5.83 C449.4 | v10.32,6.51 10.73,6.51 | v12.22,4.6 14.29,4.6 15.72,3.17 19.37,3.17 21.91,5.71 v21.91,6.67 | 10.79,6.51 10.73,6.51
  Bottom 0.152: 21.75,16.51 21.75,15.56 U301.3 21.91,15.4 22.38,14.92 22.38,9.37 21.91,8.89 D302.2 21.91,8.73 v21.91,6.67 | 21.75,16.51 21.75,16.83 21.59,16.99 C301.1 | v12.22,4.6 v10.32,6.51 | 21.75,16.51 J301.2
XTAL1
  Top 0.152: U401.62 17.23,5.73 Y401.3 | 17.94,5.41 arc-90 Y401.3 | C1.3 17.8,5.91 Y401.3
XTAL2
  Top 0.152: U401.61 16.76,7.86 16.76,5.08 16.11,4.43 Y401.1 16.76,3.58 16.76,3.56 18.8,3.56 C1.4

### Text on the board
tPlace: Baro | 9DoF | HiAcc | +
bPlace: Boot | Reset